# Altium schematic sheet Sheet1.SchDoc
size B; SheetNumber: 1; SheetTotal: 1
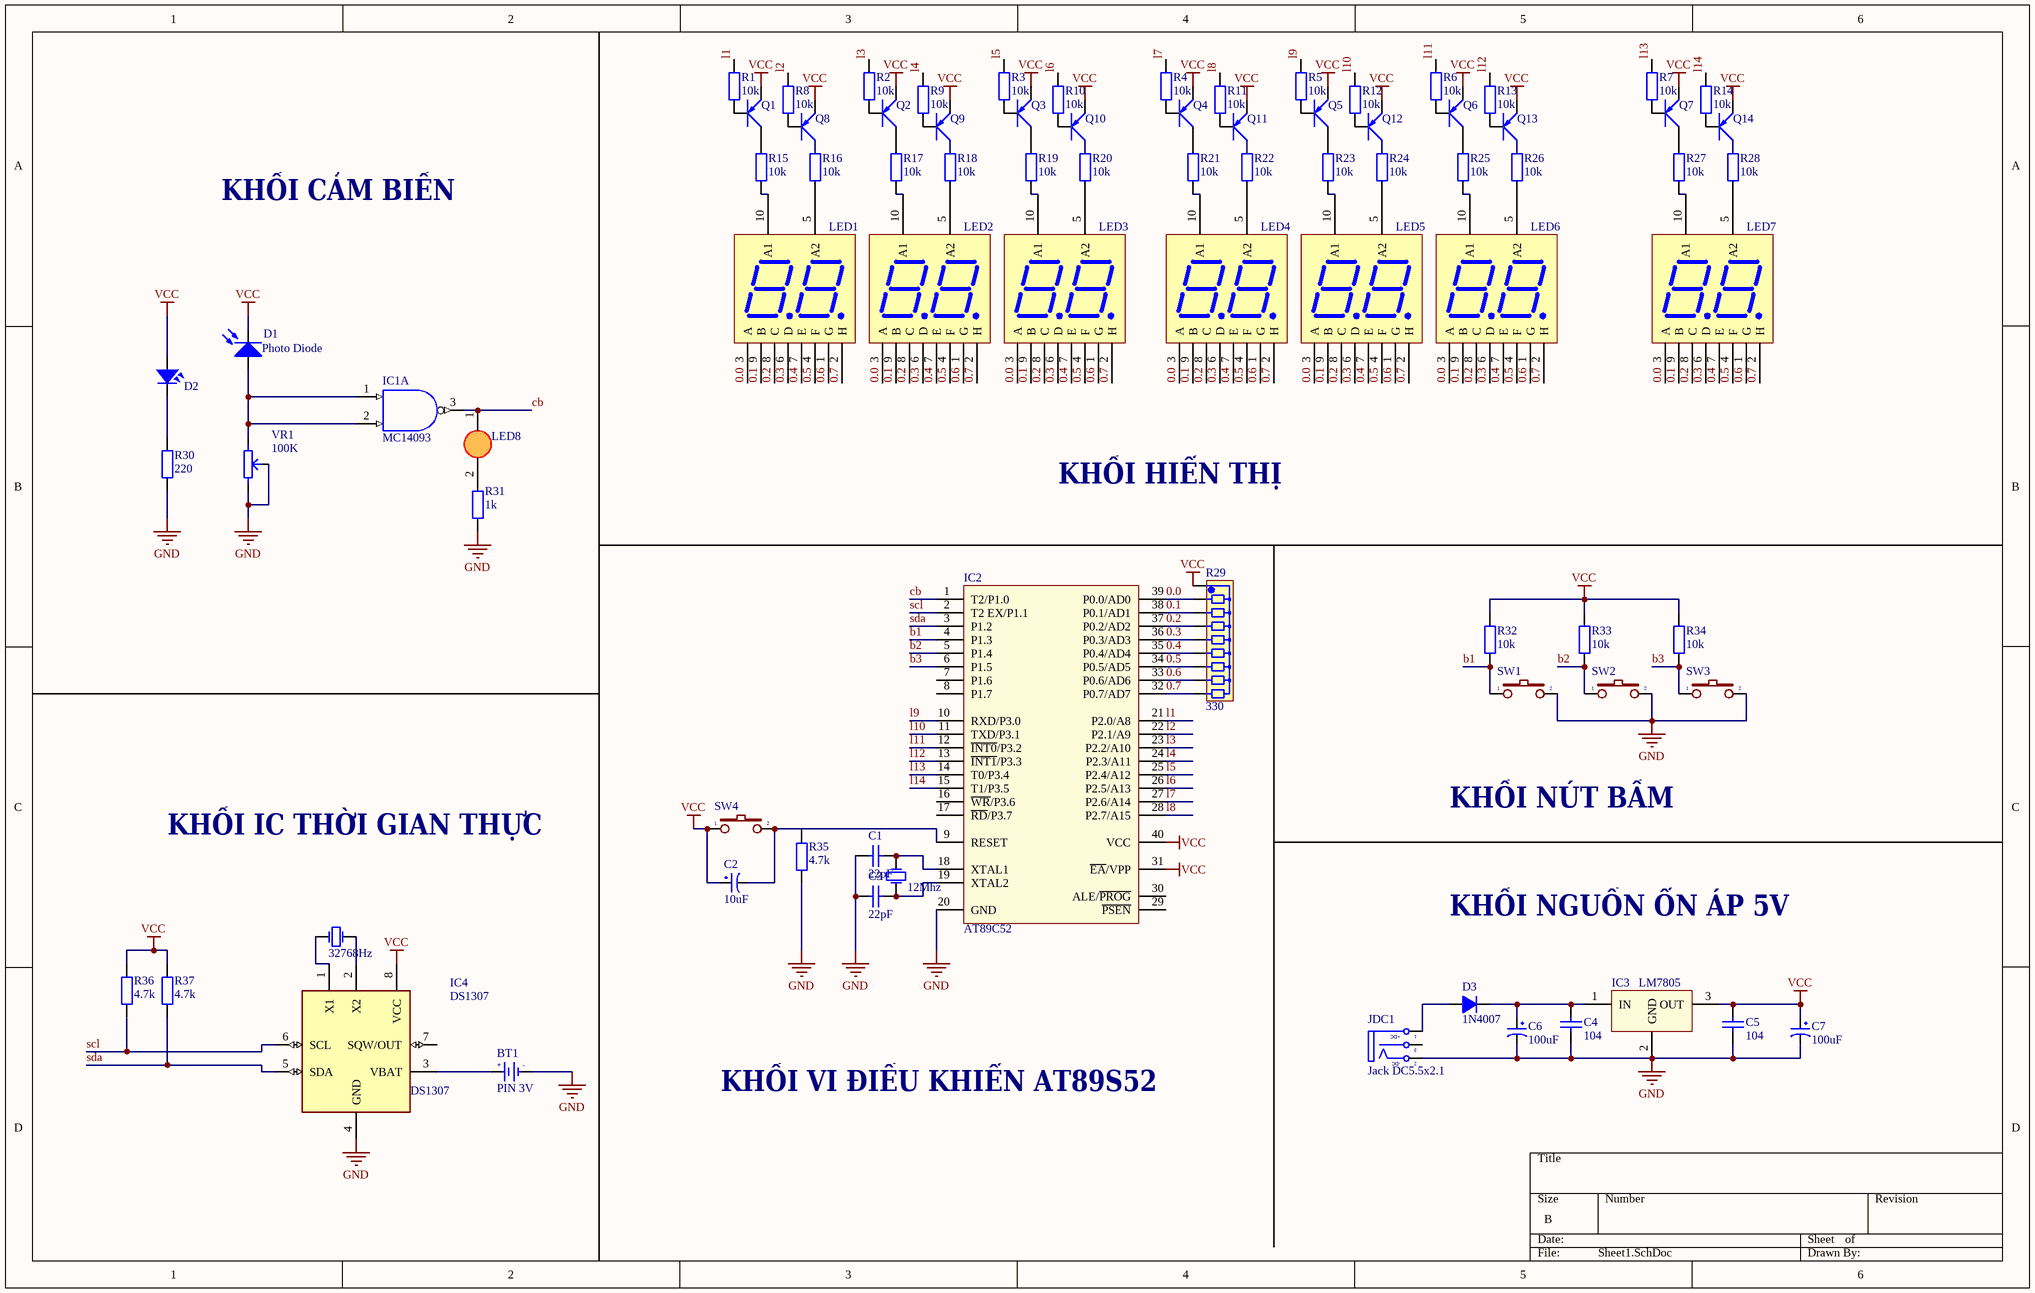
[diagram p0: Sheet1.SchDoc]

## Parts
BT1  PIN 3V  [PIN3V]
C1  22pF  [tu gom]
C2  10uF  [tu hoa 4mm]
C3  22pF  [tu gom]
C4  104  [tu gom]
C5  104  [tu gom]
C6  100uF  [tu hoa 5mm]
C7  100uF  [tu hoa 5mm]
D1  Photo Diode  [LED-5-Green]
D2  Phat  [LED-3]  (value not drawn)
D3  1N4007  [Diode 1N4007]
IC1  MC14093  [DIP14/W0.3]  (part A of 4)
IC2  AT89C52  [DIP40/W0.6]
IC3  LM7805  [QTO-220]
IC4  DS1307  [DIL08]
JDC1  Jack DC5.5x2.1  [DC-IN]
LED1  Led 7 0.36 3 Số Anot ( Sáng Đỏ)  [LED 7 THANH_0.36x2]  (value not drawn)
LED2  Led 7 0.36 3 Số Anot ( Sáng Đỏ)  [LED 7 THANH_0.36x2]  (value not drawn)
LED3  Led 7 0.36 3 Số Anot ( Sáng Đỏ)  [LED 7 THANH_0.36x2]  (value not drawn)
LED4  Led 7 0.36 3 Số Anot ( Sáng Đỏ)  [LED 7 THANH_0.36x2]  (value not drawn)
LED5  Led 7 0.36 3 Số Anot ( Sáng Đỏ)  [LED 7 THANH_0.36x2]  (value not drawn)
LED6  Led 7 0.36 3 Số Anot ( Sáng Đỏ)  [LED 7 THANH_0.36x2]  (value not drawn)
LED7  Led 7 0.36 3 Số Anot ( Sáng Đỏ)  [LED 7 THANH_0.36x2]  (value not drawn)
LED8  (no value)  [LED 3mm Do]
Q1  (no value)  [QTO-92]
Q2  (no value)  [QTO-92]
Q3  (no value)  [QTO-92]
Q4  (no value)  [QTO-92]
Q5  (no value)  [QTO-92]
Q6  (no value)  [QTO-92]
Q7  (no value)  [QTO-92]
Q8  (no value)  [QTO-92]
Q9  (no value)  [QTO-92]
Q10  (no value)  [QTO-92]
Q11  (no value)  [QTO-92]
Q12  (no value)  [QTO-92]
Q13  (no value)  [QTO-92]
Q14  (no value)  [QTO-92]
R1  10k  [tro vach 1/4w]
R2  10k  [tro vach 1/4w]
R3  10k  [tro vach 1/4w]
R4  10k  [tro vach 1/4w]
R5  10k  [tro vach 1/4w]
R6  10k  [tro vach 1/4w]
R7  10k  [tro vach 1/4w]
R8  10k  [tro vach 1/4w]
R9  10k  [tro vach 1/4w]
R10  10k  [tro vach 1/4w]
R11  10k  [tro vach 1/4w]
R12  10k  [tro vach 1/4w]
R13  10k  [tro vach 1/4w]
R14  10k  [tro vach 1/4w]
R15  10k  [tro vach 1/4w]
R16  10k  [tro vach 1/4w]
R17  10k  [tro vach 1/4w]
R18  10k  [tro vach 1/4w]
R19  10k  [tro vach 1/4w]
R20  10k  [tro vach 1/4w]
R21  10k  [tro vach 1/4w]
R22  10k  [tro vach 1/4w]
R23  10k  [tro vach 1/4w]
R24  10k  [tro vach 1/4w]
R25  10k  [tro vach 1/4w]
R26  10k  [tro vach 1/4w]
R27  10k  [tro vach 1/4w]
R28  10k  [tro vach 1/4w]
R29  330  [tro bang a9]
R30  220  [tro vach 1/4w]
R31  1k  [tro vach 1/4w]
R32  10k  [tro vach 1/4w]
R33  10k  [tro vach 1/4w]
R34  10k  [tro vach 1/4w]
R35  4.7k  [tro vach 1/4w]
R36  4.7k  [tro vach 1/4w]
R37  4.7k  [tro vach 1/4w]
SW1  (no value)  [SW2]
SW2  (no value)  [SW2]
SW3  (no value)  [SW2]
SW4  (no value)  [SW2]
VR1  100K  [BIEN TRO TAM GIAC]
Y1  12Mhz  [THACH ANH CAM]
Y2  32768Hz  [XT2]

## Nets
GND: BT1.2(GND) C1.2 C3.2 C4.2 C5.2 C6.2 C7.2 IC1.7(GND) IC2.20(GND) IC3.2(GND) IC4.4(GND) JDC1.2(TN) R30.1 R31.1 R35.1 SW1.2 SW2.2 SW3.2 VR1.2 VR1.3
VCC: C2.1 C5.1 C7.1 D1.2(K) D2.1 IC2.31(~{EA}/VPP) IC2.40(VCC) IC3.3(OUT) IC4.8(VCC) Q1.1(E) Q2.1(E) Q3.1(E) Q4.1(E) Q5.1(E) Q6.1(E) Q7.1(E) Q8.1(E) Q9.1(E) Q10.1(E) Q11.1(E) Q12.1(E) Q13.1(E) Q14.1(E) R29.1 R32.2 R33.2 R34.2 R36.2 R37.2 SW4.1
VDD: IC1.14(VDD)
0.0: IC2.39(P0.0/AD0) LED1.3(A) LED2.3(A) LED3.3(A) LED4.3(A) LED5.3(A) LED6.3(A) LED7.3(A) R29.2
0.1: IC2.38(P0.1/AD1) LED1.9(B) LED2.9(B) LED3.9(B) LED4.9(B) LED5.9(B) LED6.9(B) LED7.9(B) R29.3
0.2: IC2.37(P0.2/AD2) LED1.8(C) LED2.8(C) LED3.8(C) LED4.8(C) LED5.8(C) LED6.8(C) LED7.8(C) R29.4
0.3: IC2.36(P0.3/AD3) LED1.6(D) LED2.6(D) LED3.6(D) LED4.6(D) LED5.6(D) LED6.6(D) LED7.6(D) R29.5
0.4: IC2.35(P0.4/AD4) LED1.7(E) LED2.7(E) LED3.7(E) LED4.7(E) LED5.7(E) LED6.7(E) LED7.7(E) R29.6
0.5: IC2.34(P0.5/AD5) LED1.4(F) LED2.4(F) LED3.4(F) LED4.4(F) LED5.4(F) LED6.4(F) LED7.4(F) R29.7
0.6: IC2.33(P0.6/AD6) LED1.1(G) LED2.1(G) LED3.1(G) LED4.1(G) LED5.1(G) LED6.1(G) LED7.1(G) R29.8
0.7: IC2.32(P0.7/AD7) LED1.2(H) LED2.2(H) LED3.2(H) LED4.2(H) LED5.2(H) LED6.2(H) LED7.2(H) R29.9
b1: IC2.4(P1.3) R32.1 SW1.1
b2: IC2.5(P1.4) R33.1 SW2.1
b3: IC2.6(P1.5) R34.1 SW3.1
cb: IC1.3(~{Y}) IC2.1(T2/P1.0) LED8.1(A)
l1: IC2.21(P2.0/A8) R1.2
l2: IC2.22(P2.1/A9) R8.2
l3: IC2.23(P2.2/A10) R2.2
l4: IC2.24(P2.3/A11) R9.2
l5: IC2.25(P2.4/A12) R3.2
l6: IC2.26(P2.5/A13) R10.2
l7: IC2.27(P2.6/A14) R4.2
l8: IC2.28(P2.7/A15) R11.2
l9: IC2.10(RXD/P3.0) R5.2
l10: IC2.11(TXD/P3.1) R12.2
l11: IC2.12(~{INT0}/P3.2) R6.2
l12: IC2.13(~{INT1}/P3.3) R13.2
l13: IC2.14(T0/P3.4) R7.2
l14: IC2.15(T1/P3.5) R14.2
scl: IC2.2(T2_EX/P1.1) IC4.6(SCL) R36.1
sda: IC2.3(P1.2) IC4.5(SDA) R37.1
NetBT1_1: BT1.1(+3V) IC4.3(VBAT)
NetC1_1: C1.1 IC2.18(XTAL1) Y1.2(OSC2)
NetC2_2: C2.2 IC2.9(RESET) SW4.2
NetC3_1: C3.1 IC2.19(XTAL2) Y1.1(OSC1)
NetC4_1: C4.1 C6.1 D3.2(K) IC3.1(IN)
NetD1_1: D1.1(A) IC1.1(A) IC1.2(B) VR1.1
NetD2_2: D2.2 R30.2
NetD3_1: D3.1(A) JDC1.1(T)
NetIC4_1: IC4.1(X1) Y2.1(OSC1)
NetIC4_2: IC4.2(X2) Y2.2(OSC2)
NetLED1_5: LED1.5(A2) R16.1
NetLED1_10: LED1.10(A1) R15.1
NetLED2_5: LED2.5(A2) R18.1
NetLED2_10: LED2.10(A1) R17.1
NetLED3_5: LED3.5(A2) R20.1
NetLED3_10: LED3.10(A1) R19.1
NetLED4_5: LED4.5(A2) R22.1
NetLED4_10: LED4.10(A1) R21.1
NetLED5_5: LED5.5(A2) R24.1
NetLED5_10: LED5.10(A1) R23.1
NetLED6_5: LED6.5(A2) R26.1
NetLED6_10: LED6.10(A1) R25.1
NetLED7_5: LED7.5(A2) R28.1
NetLED7_10: LED7.10(A1) R27.1
NetLED8_2: LED8.2(K) R31.2
NetQ1_2: Q1.2(C) R15.2
NetQ1_3: Q1.3(B) R1.1
NetQ2_2: Q2.2(C) R17.2
NetQ2_3: Q2.3(B) R2.1
NetQ3_2: Q3.2(C) R19.2
NetQ3_3: Q3.3(B) R3.1
NetQ4_2: Q4.2(C) R21.2
NetQ4_3: Q4.3(B) R4.1
NetQ5_2: Q5.2(C) R23.2
NetQ5_3: Q5.3(B) R5.1
NetQ6_2: Q6.2(C) R25.2
NetQ6_3: Q6.3(B) R6.1
NetQ7_2: Q7.2(C) R27.2
NetQ7_3: Q7.3(B) R7.1
NetQ8_2: Q8.2(C) R16.2
NetQ8_3: Q8.3(B) R8.1
NetQ9_2: Q9.2(C) R18.2
NetQ9_3: Q9.3(B) R9.1
NetQ10_2: Q10.2(C) R20.2
NetQ10_3: Q10.3(B) R10.1
NetQ11_2: Q11.2(C) R22.2
NetQ11_3: Q11.3(B) R11.1
NetQ12_2: Q12.2(C) R24.2
NetQ12_3: Q12.3(B) R12.1
NetQ13_2: Q13.2(C) R26.2
NetQ13_3: Q13.3(B) R13.1
NetQ14_2: Q14.2(C) R28.2
NetQ14_3: Q14.3(B) R14.1

Not connected (* = marked no-connect by the designer): IC2 7(P1.6) 8(P1.7) 16(~{WR}/P3.6) 17(~{RD}/P3.7) 29(~{PSEN}) 30(ALE/~{PROG}); IC4 7(SQW/OUT); JDC1 3(S); R35 2

## Notes on the sheet
- KHỐI CẢM BIẾN
- KHỐI HIỂN THỊ
- KHỐI IC THỜI GIAN THỰC
- KHỐI NÚT BẤM
- KHỐI NGUỒN ỔN ÁP 5V
- KHỐI VI ĐIỀU KHIỂN AT89S52
- (in symbol Jac_DC) +DC; -DC
- (in symbol PIN 3V) +; -

## Library data of the parts
BT1 = PIN 3V: Battery 3VDC; Value: PIN 3V
C1 C3 = Tu gom 22pF 50V: Cắm; Don_Vi: Con; So_Chan: 2; Ten_Linh_Kien: Tụ gốm 22P 50V; Ma_Hang: MH004771; Chung_Loai: Cắm; Kieu_Chan: *
C2 = Tu Hoa 10uF 16V 4x7: Cắm; So_Chan: 2; Don_Vi: Con; Ten_Linh_Kien: Tụ Hóa 10uF 16V; Ma_Hang: MH006855; Chung_Loai: Cắm; Kieu_Chan: *
C4 C5 = Tu gom 104 50V: Cắm; So_Chan: 2; Ten_Linh_Kien: Tụ gốm 104 100nF 50V; Don_Vi: Con; Ma_Hang: MH004761; Chung_Loai: Cắm; Kieu_Chan: *
C6 C7 = Tu Hoa 100uF 16V 5x7: Cắm; Don_Vi: Con; So_Chan: 2; Ten_Linh_Kien: Tụ Hóa 100uF 16V 5x7MM; Ma_Hang: MH001347; Chung_Loai: Cắm; Kieu_Chan: *
D1 = Photo Diode: Photosensitive Diode
D2 = LED: LED phat hong ngoai; Value: LED 3 ly Single Colour
D3 = D1A: Diode 1A; Value: 1N4007
IC1 = MC14093: Quad 2-Input NAND Schmitt Trigger; Value: MC14093
IC2 = AT89C52: Cắm; Ten_Linh_Kien: AT89C52-24PC DIP40; Don_Vi: Con; Ma_Hang: MH002200; Ghi_Chu: *; Kieu _Chan: *; Chung_Loai: Cắm
IC3 = LM78xx: On ap +, from + 5 to + 24VDC; Value: LM7805
IC4 = DS1307: Real Time Clock (RTC) IC Clock/Calendar 56B IÂ²C, 2-Wire Serial 8-SOIC (0.154, 3.90mm Width); MF: Analog Devices; SnapEDA_Link: https://www.snapeda.com/parts/DS1307/Analog+Devices/view-part/?ref=snap; Package: DIP-8 Maxim Integrated; Value: *; MP: DS1307; Check_prices: https://www.snapeda.com/parts/DS1307/Analog+Devices/view-part/?ref=eda
JDC1 = Jac_DC: Cắm; Ten_Linh_Kien: Jack DC5.5x2.1MM DC5501; Ma_Hang: MH000923; Don_Vi: Con; Kieu_Chan: *; Ghi_Chu: *; Chung_Loai: Cắm
LED1-LED7 = LED 7 2 SO 0.36_A: Cắm; Don_Vi: Con; Ma_Hang: MH001046; Ten_Linh_Kien: Led 7 0.36 3 Số Anot ( Sáng Đỏ); Ghi_Chu: *; Kieu_Chan: *; Chung_Loai: Cắm
LED8 = LED 3mm Do: Cắm; Ten_Linh_Kien: LED 3MM Sáng Đỏ ( SS); Ma_Hang: MH004931; Don_Vi: Con; Ghi_Chu: *; Kieu_Chan: *; Chung_Loai: Cắm
Q1-Q14 = A1015: PNP 600mW, ECB; Value: A1015
R1-R28 R30 R32-R34 = Tro Vach 1/4W 1% 10k: Cắm; Don_Vi: Con; So_Chan: 2; Ten_Linh_Kien: Trở Vạch 1/4w 1% 10k; Ma_Hang: MH006349; Chung_Loai: Cắm; Kieu_Chan: *
R29 = Tro Bang A9 330R: Cắm; Don_Vi: Con; So_Chan: 9; Ten_Linh_Kien: Trở Băng A09-331 330R 1/8w 5%; Ma_Hang: MH001436; Chung_Loai: Cắm; Kieu_Chan: *
R31 = Tro Vach 1/4W 5% 1k: Cắm; Don_Vi: Con; So_Chan: 2; Ten_Linh_Kien: Trở Vạch 1/4w 5% 1k; Ma_Hang: MH007390; Chung_Loai: Cắm; Kieu_Chan: *
R35-R37 = Tro Vach 1/4W 1% 4.7k: Cắm; Don_Vi: Con; So_Chan: 2; Ten_Linh_Kien: Trở Vạch 1/4w 1% 4.7k; Ma_Hang: MH006350; Chung_Loai: Cắm; Kieu_Chan: *
SW1-SW4 = Nut Nhan 2 Chan ( Dip ): Cắm; Ten_Linh_Kien: Nút Nhấn 2 Chân 6x6x5MM DIP; Ma_Hang: MH001959; Don_Vi: Con; Kieu_Chan: *; Ghi_Chu: *; Chung_Loai: Cắm
VR1 = Bien tro tam giac 1K: Cắm; Ten_Linh_Kien: Biến Trở Tam Giác 102-1K RM065; Don_Vi: Con; Ma_Hang: MH003709; Ghi_Chu: *; Kieu_Chan: *; Chung_Loai: Cắm
Y1 Y2 = Thach Anh 8Mhz DIP: Cắm; Don_Vi: Con; Ghi_Chu: *; Ma_Hang: *; Kieu_CHan: *; Chung_Loai: Cắm